# EasyEDA Pro project OSC-chaosheng.eprj, board 主板
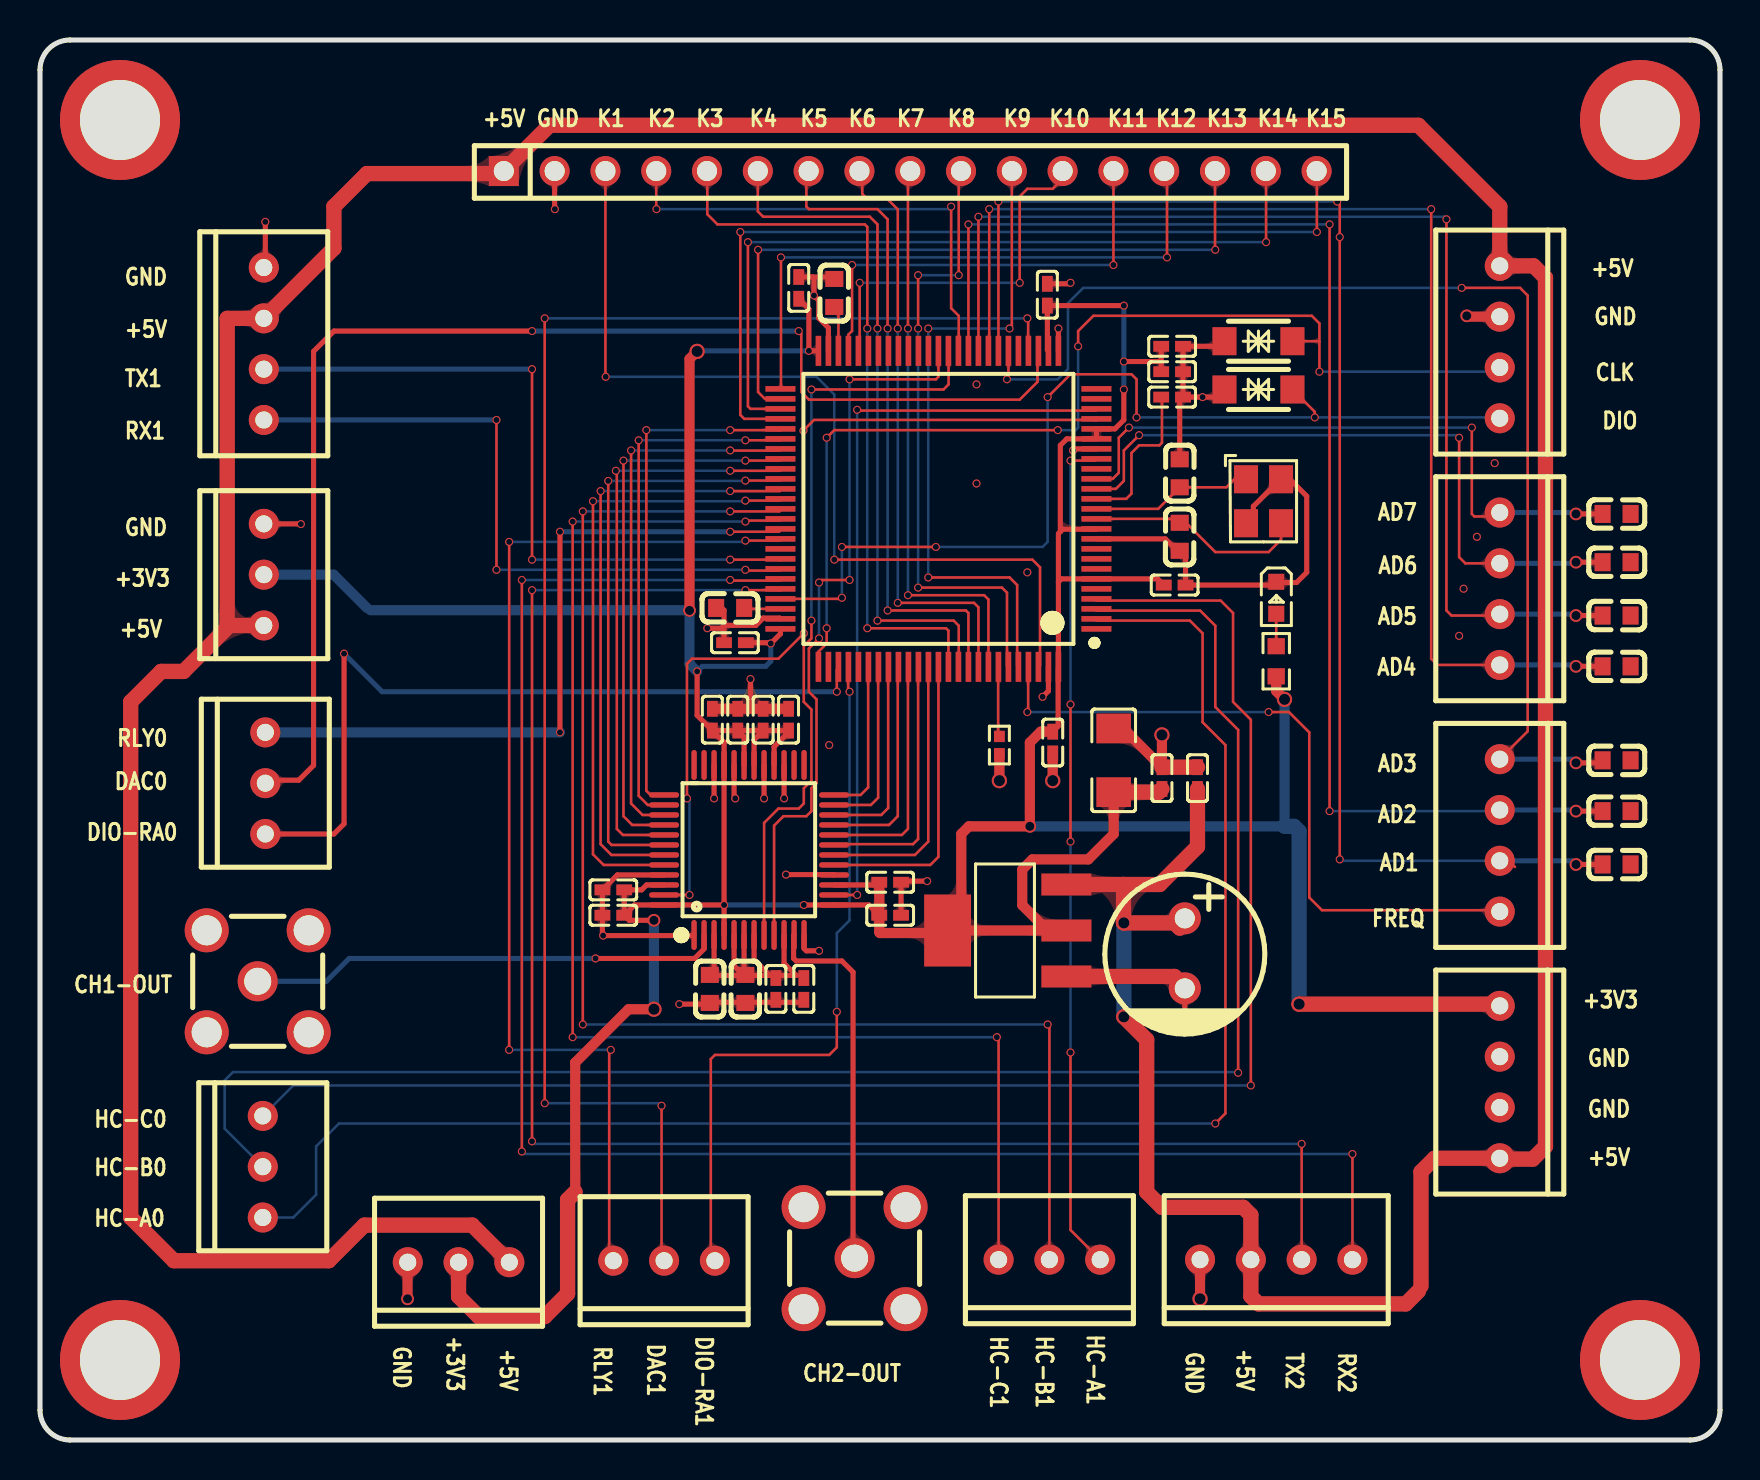
[diagram p11: board, top side]
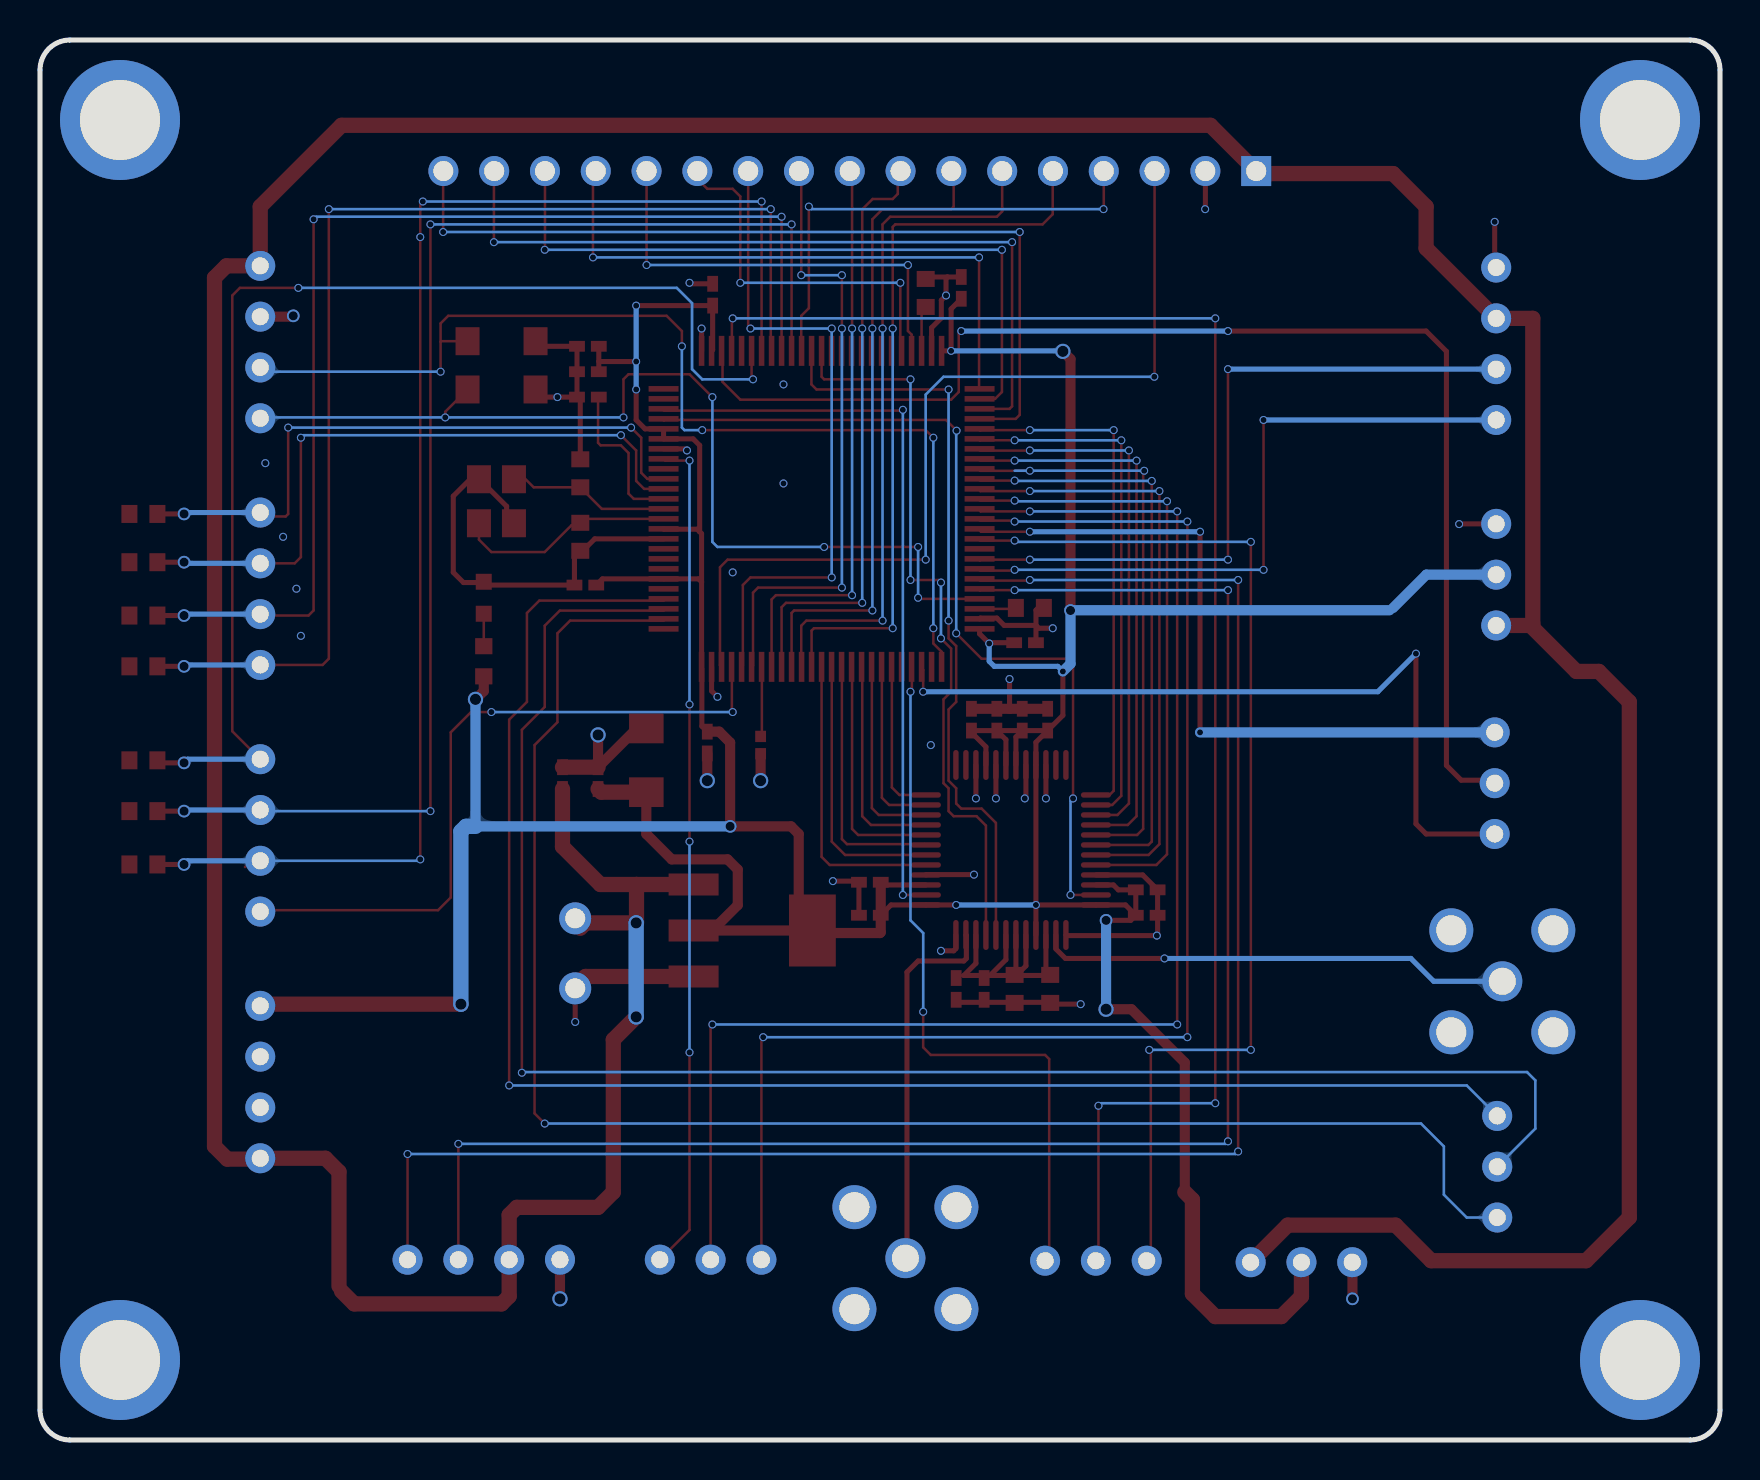
[diagram p12: board, bottom side, seen from below]

Outline 84 x 70 mm; copper layers: Top Layer, Bottom Layer. Coordinates in mm from the lower left corner of the outline.
Outline path: 0,68.5 0,1.5 arc(0.44,0.44) 1.5,0 82.5,0 arc(83.56,0.44) 84,1.5 84,68.5 arc(83.56,69.56) 82.5,70 1.5,70 arc(0.44,69.56) 0,68.5
Stack: Top Layer 0.035mm / Dielectric1 1.51mm FR4 er 4.5 / Bottom Layer 0.035mm

## Design rules (mm)
template: 自定义配置
spacing copperThickness1oz (default): track to track 0.107, other pairs 0.107 to 0.107
spacing copperThickness2oz: track to track 0.203, other pairs 0.152 to 0.3
track width copperThickness1oz (default): min 0.127, default 0.254, max 2.54
track width copperThickness2oz: min 0.203, default 0.254, max 2.54
track width VCCandGND: min 0.254, default 0.762, max 2.54
differential pair differentialPair (default): width min 0.127, default 0.254, max 2.54; gap min 0.152, default 0.152
via viaSize (default): diameter min 0.3, default 0.61, max 10; hole min 0.15, default 0.305, max 6.299
net GND uses VCCandGND
net +3V3 uses VCCandGND
net +5V uses VCCandGND

## Placement (name value [footprint] x y rotation side)
C1  100nF  [C0402]  34.89 36.02 270 top
C2  100nF  [C0402]  36.16 36.02 270 top
C3  100nF  [C0402]  37.43 36.02 270 top
C4  100nF  [C0402]  42.51 27.89 180 top
C5  100nF  [C0402]  33.62 36.02 270 top
C6  100nF  [C0402]  28.66 27.51 0 top
C7  100nF  [C0402]  28.66 26.24 0 top
C8  100nF  [C0402]  42.51 26.24 180 top
C11  22uF  [C0603]  35.27 22.55 90 top
C12  22uF  [C0603]  33.49 22.55 90 top
C14  100nF  [C0402]  56.6 52.14 0 top
C16  22uF  [C0603]  34.51 41.6 0 top
C20  22uF  [C0603]  39.71 57.35 90 top
C21  100nF  [C0402]  34.75 39.86 0 top
C22  100nF  [C0402]  50.64 34.87 90 top
C23  100nF  [C0402]  56.73 42.75 180 top
C24  100nF  [C0402]  37.94 57.61 270 top
C25  100nF  [C0402]  56.6 53.42 180 top
C26  100nF  [C0402]  56.6 54.69 180 top
C27  100nF  [C0402]  50.37 57.26 270 top
C28  100nF  [C0402]  38.19 22.55 90 top
C29  100nF  [C0402]  36.79 22.55 90 top
C32  22pF  [C0603]  56.99 45.16 90 top
C33  22pF  [C0603]  56.99 48.33 270 top
C38  100nF  [C0402]  57.88 33.09 270 top
C39  100nF  [C0402]  56.1 33.09 270 top
C40  100uF  [C1206]  53.68 33.98 270 top
C41  470uF  [CAP-TH_BD8.0-P3.50-D0.6-FD_1]  57.24 24.33 270 top
C42  330nF  [C0603]  78.83 28.78 180 top
C43  330nF  [C0603]  78.83 31.44 180 top
C44  330nF  [C0603]  78.83 33.98 180 top
C45  330nF  [C0603]  78.83 38.68 180 top
C46  330nF  [C0603]  78.83 41.22 180 top
C47  330nF  [C0603]  78.83 43.89 180 top
C48  330nF  [C0603]  78.83 46.3 180 top
J1  -  [CH2.54-4插座]  11.19 54.81 90 top
J2  -  [CH2.54-4插座]  61.81 9.02 180 top
J3  -  [CH2.54-4插座]  72.99 17.9 270 top
J4  -  [CH2.54-17P]  43.52 63.4 0 top
J5  SWD  [CH2.54-4插座]  72.99 54.9 270 top
J6  -  [CH2.54-3插座]  11.19 43.27 90 top
J7  -  [CH2.54-3插座]  20.93 8.89 180 top
J8  -  [CH2.54-4插座]  72.99 30.23 270 top
J11  -  [CH2.54-4插座]  72.99 42.56 270 top
J12  -  [CH2.54-3插座]  11.14 13.66 90 top
J13  -  [CH2.54-3插座]  50.47 9.02 180 top
J14  -  [CH2.54-3插座]  11.27 32.84 90 top
J15  -  [CH2.54-3插座]  31.21 8.97 180 top
LED1  KT-0603R  [LED0603-RD]  61.81 42.11 270 top
NOREF  -  [Pad_e11814]  4 4 0 top
NOREF#2  -  [Pad_e11812]  80 66 0 top
NOREF#3  -  [Pad_e11815]  80 4 0 top
NOREF#4  -  [Pad_e11813]  4 66 0 top
R1  10kΩ  [R0402]  47.97 34.75 270 top
R4  5.1kΩ  [R0603]  61.81 38.94 90 top
RF4  BWSMA-KE-Z001  [SMA-TH_BWSMA-KE-Z001]  10.89 22.94 0 top
RF5  BWSMA-KE-Z001  [SMA-TH_BWSMA-KE-Z001]  40.73 9.09 0 top
U1  STM32H750VBT6TR  [QFP-100_L14.0-W14.0-P0.50-LS16.0-BL]  44.92 46.56 90 top
U2  AD9288BSTZ-100  [LQFP-48_L7.0-W7.0-P0.50-LS9.0-BL]  35.45 29.5 0 top
U6  SMF7.5CA  [SOD-123FL_L2.8-W1.8-LS3.7-BI]  60.92 52.53 180 top
U7  SMF7.5CA  [SOD-123FL_L2.8-W1.8-LS3.7-BI]  60.92 54.94 180 top
U8  AMS1117-3.3  [SOT-223-3_L6.5-W3.4-P2.30-LS7.0-BR]  48.35 25.47 0 top
X2  25MHz  [OSC-SMD_4P-L3.2-W2.5-BL]  61.18 46.94 270 top

## Footprints (pads in the part's own frame, mm; a bottom-side part is the same pattern mirrored in y, then rotated)
C0402
  rect 0.79x0.54 smd: 1(-0.545,0) 2(0.545,0)
C0603
  rect 0.8x0.9 smd: 1(-0.7,0) 2(0.7,0)
C1206
  rect 1.485x1.728 smd: 1(-1.593,0) 2(1.593,0)
CAP-TH_BD8.0-P3.50-D0.6-FD_1
  round 1.6 hole 1: 1(-1.75,0) 2(1.75,0)
CH2.54-3插座
  round 1.5 hole 0.85: 1(-2.54,0) 2(0,0) 3(2.54,0)
CH2.54-4插座
  round 1.5 hole 0.85: 1(-3.81,0) 2(-1.27,0) 3(1.27,0) 4(3.81,0)
CH2.54-17P
  rect 1.5x1.5 hole 1: 1(-20.332,0.051)
  round 1.5 hole 1: 2(-17.793,0.051) 3(-15.252,0.051) 4(-12.713,0.051) 5(-10.172,0.051) 6(-7.633,0.051) 7(-5.093,0.051) 8(-2.553,0.051) 9(-0.013,0.051) 10(2.527,0.051) 11(5.067,0.051) 12(7.607,0.051) 13(10.148,0.051) 14(12.688,0.051) 15(15.227,0.051) 16(17.767,0.051) 17(20.308,0.051)
LED0603-RD
  rect 0.8x0.8 smd: 1(-0.799,0) 2(0.799,0)
LQFP-48_L7.0-W7.0-P0.50-LS9.0-BL
  oval 0.27x1.5 smd: 1(-2.75,-4.25) 2(-2.25,-4.25) 3(-1.75,-4.25) 4(-1.25,-4.25) 5(-0.75,-4.25) 6(-0.25,-4.25) 7(0.25,-4.25) 8(0.75,-4.25) 9(1.25,-4.25) 10(1.75,-4.25) 11(2.25,-4.25) 12(2.75,-4.25) 25(2.75,4.25) 26(2.25,4.25) 27(1.75,4.25) 28(1.25,4.25) 29(0.75,4.25) 30(0.25,4.25) 31(-0.25,4.25) 32(-0.75,4.25) 33(-1.25,4.25) 34(-1.75,4.25) 35(-2.25,4.25) 36(-2.75,4.25)
  oval 1.5x0.27 smd: 13(4.25,-2.75) 14(4.25,-2.25) 15(4.25,-1.75) 16(4.25,-1.25) 17(4.25,-0.75) 18(4.25,-0.25) 19(4.25,0.25) 20(4.25,0.75) 21(4.25,1.25) 22(4.25,1.75) 23(4.25,2.25) 24(4.25,2.75) 37(-4.25,2.75) 38(-4.25,2.25) 39(-4.25,1.75) 40(-4.25,1.25) 41(-4.25,0.75) 42(-4.25,0.25) 43(-4.25,-0.25) 44(-4.25,-0.75) 45(-4.25,-1.25) 46(-4.25,-1.75) 47(-4.25,-2.25) 48(-4.25,-2.75)
OSC-SMD_4P-L3.2-W2.5-BL
  rect 1.4x1.2 smd: 1(-1.1,-0.875) 2(1.1,-0.875) 3(1.1,0.875) 4(-1.1,0.875)
Pad_e11812
  round 6 hole 4: 2(0,0)
Pad_e11813
  round 6 hole 4: 1(0,0)
Pad_e11814
  round 6 hole 4: 3(0,0)
Pad_e11815
  round 6 hole 4: 4(0,0)
QFP-100_L14.0-W14.0-P0.50-LS16.0-BL
  rect 0.28x1.5 smd: 1(-6,-7.9) 2(-5.5,-7.9) 3(-5,-7.9) 4(-4.5,-7.9) 5(-4,-7.9) 6(-3.5,-7.9) 7(-3,-7.9) 8(-2.5,-7.9) 9(-2,-7.9) 10(-1.5,-7.9) 11(-1,-7.9) 12(-0.5,-7.9) 13(0,-7.9) 14(0.5,-7.9) 15(1,-7.9) 16(1.5,-7.9) 17(2,-7.9) 18(2.5,-7.9) 19(3,-7.9) 20(3.5,-7.9) 21(4,-7.9) 22(4.5,-7.9) 23(5,-7.9) 24(5.5,-7.9) 25(6,-7.9) 51(6,7.9) 52(5.5,7.9) 53(5,7.9) 54(4.5,7.9) 55(4,7.9) 56(3.5,7.9) 57(3,7.9) 58(2.5,7.9) 59(2,7.9) 60(1.5,7.9) 61(1,7.9) 62(0.5,7.9) 63(0,7.9) 64(-0.5,7.9) 65(-1,7.9) 66(-1.5,7.9) 67(-2,7.9) 68(-2.5,7.9) 69(-3,7.9) 70(-3.5,7.9) 71(-4,7.9) 72(-4.5,7.9) 73(-5,7.9) 74(-5.5,7.9) 75(-6,7.9)
  rect 1.5x0.28 smd: 26(7.9,-6) 27(7.9,-5.5) 28(7.9,-5) 29(7.9,-4.5) 30(7.9,-4) 31(7.9,-3.5) 32(7.9,-3) 33(7.9,-2.5) 34(7.9,-2) 35(7.9,-1.5) 36(7.9,-1) 37(7.9,-0.5) 38(7.9,0) 39(7.9,0.5) 40(7.9,1) 41(7.9,1.5) 42(7.9,2) 43(7.9,2.5) 44(7.9,3) 45(7.9,3.5) 46(7.9,4) 47(7.9,4.5) 48(7.9,5) 49(7.9,5.5) 50(7.9,6) 76(-7.9,6) 77(-7.9,5.5) 78(-7.9,5) 79(-7.9,4.5) 80(-7.9,4) 81(-7.9,3.5) 82(-7.9,3) 83(-7.9,2.5) 84(-7.9,2) 85(-7.9,1.5) 86(-7.9,1) 87(-7.9,0.5) 88(-7.9,0) 89(-7.9,-0.5) 90(-7.9,-1) 91(-7.9,-1.5) 92(-7.9,-2) 93(-7.9,-2.5) 94(-7.9,-3) 95(-7.9,-3.5) 96(-7.9,-4) 97(-7.9,-4.5) 98(-7.9,-5) 99(-7.9,-5.5) 100(-7.9,-6)
R0402
  rect 0.566x0.54 smd: 1(-0.433,0) 2(0.433,0)
R0603
  rect 0.806x0.864 smd: 1(-0.753,0) 2(0.753,0)
SMA-TH_BWSMA-KE-Z001
  round 2.2 hole 1.5: 1(-2.55,-2.55) 2(-2.55,2.55) 3(2.55,2.55) 4(2.55,-2.55)
  round 2 hole 1.35: 5(0,0)
SOD-123FL_L2.8-W1.8-LS3.7-BI
  rect 1.2x1.4 smd: 1(-1.7,0) 2(1.7,0)
SOT-223-3_L6.5-W3.4-P2.30-LS7.0-BR
  rect 2.5x1.1 smd: 1(2.97,-2.3) 2(2.97,0) 3(2.97,2.3)
  rect 2.34x3.6 smd: 4(-2.97,0)

## Nets
+3V3: C1.2 C2.2 C3.2 C4.2 C5.2 C6.2 C7.2 C8.2 C21.2 C22.2 C23.2 C24.2 C25.2 C26.2 C27.2 C39.2 C40.2 J3.1 J6.2 J7.2 R4.1 U1.6 U1.11 U1.20 U1.21 U1.27 U1.50 U1.75 U1.100 U2.4 U2.13 U2.15 U2.28 U2.30 U2.31 U2.33 U2.46 U2.48 U8.2 U8.4
+5V: C38.2 C41.1 J1.3 J2.3 J3.4 J4.1 J5.1 J6.1 J7.1 U8.3
GND: C1.1 C2.1 C3.1 C4.1 C5.1 C6.1 C7.1 C8.1 C11.1 C12.1 C14.2 C16.1 C20.2 C21.1 C22.1 C23.1 C24.1 C25.1 C26.1 C27.1 C28.1 C29.1 C32.1 C33.1 C38.1 C39.1 C40.1 C41.2 C42.1 C43.1 C44.1 C45.1 C46.1 C47.1 C48.1 J1.4 J2.4 J3.2 J3.3 J4.2 J5.2 J6.3 J7.3 LED1.1 NOREF.3 NOREF#2.2 NOREF#3.4 NOREF#4.1 R1.2 RF4.1 RF4.2 RF4.3 RF4.4 RF5.1 RF5.2 RF5.3 RF5.4 U1.10 U1.19 U1.26 U1.49 U1.74 U1.99 U2.1 U2.12 U2.16 U2.27 U2.29 U2.32 U2.34 U2.45 U6.2 U7.2 U8.1 X2.2 X2.4
AD1: C42.2 J8.3 U1.32
AD2: C43.2 J8.2 U1.35
AD3: C44.2 J8.1 U1.31
AD4: C45.2 J11.4 U1.33
AD5: C46.2 J11.3 U1.34
AD6: C47.2 J11.2 U1.15
AD7: C48.2 J11.1 U1.16
CH1-OUT: RF4.5 U2.2
CH2-OUT: RF5.5 U2.11
CLK: J5.3 U1.76 U7.1
DA0: U1.55 U2.37
DA1: U1.56 U2.38
DA2: U1.57 U2.39
DA3: U1.58 U2.40
DA4: U1.59 U2.41
DA5: U1.60 U2.42
DA6: U1.61 U2.43
DA7: U1.62 U2.44
DAC0: J14.2 U1.28
DAC1: J15.2 U1.29
DB0: U1.81 U2.24
DB1: U1.82 U2.23
DB2: U1.83 U2.22
DB3: U1.84 U2.21
DB4: U1.85 U2.20
DB5: U1.86 U2.19
DB6: U1.87 U2.18
DB7: U1.88 U2.17
DIO: J5.4 U1.72 U6.1
DIO-CLKA: U1.22 U2.47
DIO-CLKB: U1.23 U2.14
DIO-RA0: J14.1 U1.78
DIO-RA1: J15.1 U1.79
DIO-S1: U1.37 U2.8
DIO-S2: U1.38 U2.9
FREQ: J8.4 U1.97
HC-A0: J12.1 U1.2
HC-A1: J13.1 U1.18
HC-B0: J12.2 U1.3
HC-B1: J13.2 U1.63
HC-C0: J12.3 U1.4
HC-C1: J13.3 U1.64
K1: J4.3 U1.98
K2: J4.4 U1.36
K3: J4.5 U1.89
K4: J4.6 U1.90
K5: J4.7 U1.91
K6: J4.8 U1.92
K7: J4.9 U1.93
K8: J4.10 U1.95
K9: J4.11 U1.96
K10: J4.12 U1.46
K11: J4.13 U1.47
K12: J4.14 U1.51
K13: J4.15 U1.52
K14: J4.16 U1.53
K15: J4.17 U1.54
OSC_IN: C32.2 U1.12 X2.3
OSC_OUT: C33.2 U1.13 X2.1
REFO: C11.2 C12.2 C28.2 C29.2 U2.3 U2.5 U2.6 U2.7 U2.10
RLY0: J14.3 U1.65
RLY1: J15.3 U1.66
RX1: J1.1 U1.69
RX2: J2.1 U1.70
TX1: J1.2 U1.68
TX2: J2.2 U1.71
$1N7062: C14.1 U1.14
$1N7469: C20.1 U1.48
$1N8680: R1.1 U1.94
$1N14131: C16.2 U1.73
$1N14803: LED1.2 R4.2

Pads without a net: U1 1 5 7 8 9 17 24 25 30 39 40 41 42 43 44 45 67 77 80; U2 25 26 35 36

## Via types
v1: diameter 0.4, hole 0.3, Top Layer to Bottom Layer, 175 vias
v2: diameter 0.762, hole 0.559, Top Layer to Bottom Layer, 10 vias
v3: diameter 0.635, hole 0.457, Top Layer to Bottom Layer, 13 vias

## Routing (per net, layer and track width the routed paths; a pad name or vN(x,y) marks a point on that pad's centre or on a via; arc(x,y) is an arc through that point)
+3V3: length 246.9
  Top Layer w0.254: 50.92,42.91 51.07,43.06 U1.6 55.88,43.06 C23.2 ; 50.92,42.91 U1.100 ; 50.92,42.91 50.92,45.32 51.02,45.41 ; C26.2 56.06,53.99 ; C2.2 C3.2 37.43,35.38 36.7,34.66 U2.28 ; C2.2 C1.2 ; C2.2 35.7,35.02 U2.30 ; C1.2 35.2,35.15 U2.31 ; C1.2 C5.2 ; C21.2 36.5,39.86 v1(36.54,39.83) 37.02,40.31 U1.75 ; C24.2 38.44,56.55 v1(38.44,54.46) 38.92,54.46 ; C25.2 56.06,53.92 v1(54.19,53.92) ; 51.02,45.41 51.14,45.54 52.81,45.54 U1.11 ; 51.02,45.41 51.02,49.73 51.34,50.06 U1.20 U1.21 53.75,50.56 54.19,51 v1(54.19,52.53) ; 50.91,38.57 50.91,35.69 C22.2 ; v1(34.2,26.75) U2.4 ; v1(34.2,26.75) U2.33 34.2,34.88 C5.2 ; v1(34.2,26.75) U2.48 29.72,26.75 C7.2 ; v1(32.86,38.43) 32.86,36.23 C5.2 ; C7.2 C6.2 30.08,27.51 30.33,27.75 U2.46 ; C7.2 29.46,25.98 v3(30.7,25.98) ; 54.19,56.72 C27.2 50.37,54.51 50.42,54.46 ; U2.15 41.83,27.75 C4.2 ; v1(38.19,26.75) U2.13 41.45,26.75 C8.2
  Top Layer w0.508: v2(62.23,37.03) 61.81,37.45 R4.1 ; 50.38,25.47 49.11,26.75 49.11,28.52 49.62,29.03 52.41,29.03 53.68,30.3 C40.2 ; 50.38,25.47 U8.2 ; 50.38,25.47 U8.4 ; v3(32.47,41.48) 32.47,54.05 v2(32.86,54.43) ; C4.2 C8.2 41.96,25.39 42,25.35 44.79,25.35 46.06,26.62 46.06,30.3 46.44,30.68 v3(49.49,30.68) 49.49,34.87 50.04,35.42 C22.2 ; 26.76,12.39 26.76,18.87 29.43,21.54 v3(30.7,21.54)
  Top Layer w0.762: C40.2 55.94,32.39 C39.2 ; J7.2 20.93,7.18 21.93,6.17 25.24,6.17 26.38,7.31 26.38,12.01 26.76,12.39 ; v2(62.96,21.79) 72.9,21.79 J3.1
  Bottom Layer w0.254: v1(36.54,39.83) 36.54,38.94 36.28,38.68 33.11,38.68 v1(32.86,38.43) ; v1(54.19,52.53) v1(54.19,53.92) v1(54.19,56.72) ; v2(32.86,54.43) 32.88,54.46 v1(38.44,54.46) ; v1(34.2,26.75) v1(38.19,26.75)
  Bottom Layer w0.508: v1(32.86,38.43) 32.47,38.81 v3(32.47,41.48) 32.46,41.49 16.52,41.49 ; v2(62.23,37.03) 62.23,30.68 v3(49.49,30.68) ; J6.2 14.68,43.27 16.35,41.6 ; v3(30.7,25.98) v3(30.7,21.54)
  Bottom Layer w0.762: v2(62.96,21.79) 62.96,30.43 62.7,30.68 62.23,30.68
+5V: length 250.4
  Top Layer w0.762: 54.17,27.78 51.32,27.78 ; 54.17,27.78 55.98,27.78 57.88,29.67 C38.2 ; 54.17,27.78 54.17,25.88 v2(54.19,25.86) 56.72,25.86 56.99,25.59 ; J7.1 21.61,10.74 16.22,10.74 14.44,8.97 6.69,8.97 4.53,11.12 4.53,36.91 6.06,38.43 7.18,38.43 9.48,40.73 ; 68.92,7.44 68.29,6.81 60.92,6.81 60.54,7.19 J2.3 60.54,11.25 60.16,11.63 56.1,11.63 55.34,12.39 55.34,20.01 v2(54.19,21.16) ; 9.48,40.73 J6.1 ; 9.48,40.73 9.36,40.73 ; 9.48,40.73 9.36,40.84 9.36,56.08 J1.3 14.69,59.59 14.69,61.67 16.35,63.32 23.06,63.32 J4.1 25.48,65.73 68.92,65.73 72.99,61.67 J5.1 74.68,58.71 75.27,58.11 75.27,14.68 74.64,14.04 73.03,14.04 72.99,14.09 69.73,14.09 69.05,13.41 69.05,7.69
  Bottom Layer w0.762: v2(54.19,21.16) v2(54.19,25.86)
GND: length 111.9
  Top Layer w0.254: v1(31.97,21.79) 33.43,21.79 C12.1 ; v1(13.04,45.8) 13.03,45.81 J6.3 ; U2.34 v1(33.7,32.08) ; v1(35.52,38.05) 35.52,36.58 35.51,36.56 ; C14.2 C25.1 C26.1 58.97,54.69 U7.2 ; C14.2 v1(58.13,52.14) 58.84,52.14 U6.2 ; C14.2 56.99,51.98 C33.1 ; 39.42,54.46 39.42,55.61 38.93,56.1 38.93,56.99 v1(38.7,57.22) 38.7,58.09 38.63,58.15 ; v1(51.53,57.86) 51.47,57.81 C27.1 ; v1(11.27,60.91) 11.27,58.7 J1.4 ; U2.27 v1(37.2,32.08) ; 34.2,40.73 34.06,40.59 v1(33.36,40.59) ; 34.2,40.73 C21.1 ; 34.2,40.73 34.2,41.49 34.09,41.6 C16.1 ; 34.2,40.73 35.79,40.73 36.16,41.1 36.98,41.1 U1.74 ; v1(44.36,27.94) 43.12,27.94 ; U2.16 39.69,28.27 v1(37.3,28.27) ; C24.1 38.63,58.15 ; 38.63,58.15 39.69,58.15 39.71,58.18 ; 33.71,21.8 33.79,21.88 38.06,21.88 38.32,22.14 ; C32.1 57.28,44.17 C23.1 61.65,42.75 LED1.1 61.85,42.87 62.83,42.87 63.34,43.38 63.34,47.19 62.49,48.04 X2.4 62.02,48.04 60.67,46.68 60.67,46.2 X2.2 ; 50.25,37.29 50.42,37.45 U1.99 ; v1(25.74,61.54) 25.73,61.56 J4.2 ; 57.11,22.79 57.24,22.66 v1(57.24,20.9) ; C4.1 C8.1 ; U2.45 28.86,28.25 C6.1 C7.1 28.12,25.26 v1(28.16,25.22) 32.67,25.22 U2.1 ; U2.12 38.2,24.57 38.32,24.46 v1(38.95,24.46) ; U1.10 56.26,45.06 56.99,44.33 ; v1(51.65,49.48) 51.73,49.56 U1.19 ; U2.29 v1(36.2,32.08) ; 50.92,54.46 v1(50.92,55.57) ; U2.32 34.7,32.08
  Top Layer w0.508: v3(71.34,56.21) 71.38,56.17 J5.2 ; C3.1 C2.1 C1.1 C5.1 ; C40.1 54.16,35.58 C39.1 v2(56.1,35.25) ; J7.3 18.38,8.88 v3(18.38,7.06) ; v2(47.97,32.97) R1.2 ; J2.4 v2(58,7.06) ; v2(50.64,32.97) C22.1
  Top Layer w0.762: C38.1 C39.1 ; 57.11,22.79 56.72,23.18 U8.1
  vias: v1(34.76,32.08) v1(39.46,34.75) v1(46.83,52.78) v1(46.83,47.83) v1(49.37,43.38) v1(50.13,37.16) v1(70.96,40.21) v1(71.18,42.56) v1(71.84,45.16) v1(72.73,48.84)
AD1: length 71.6
  Top Layer w0.127: v1(64.99,29.03) v1(64.99,60.15) 64.99,61.8 v1(64.86,61.92) ; J8.3 73.44,28.96 73.75,28.65 ; 47.92,54.46 v1(47.92,61.92)
  Top Layer w0.254: C42.2 v3(76.8,28.78)
  Bottom Layer w0.127: v1(64.86,61.92) v1(47.92,61.92) ; J8.3 65.06,28.96 v1(64.99,29.03) 64.92,28.96
  Bottom Layer w0.254: v3(76.8,28.78) 76.61,28.96 J8.3
AD2: length 67.4
  Top Layer w0.127: v1(64.48,60.78) v1(64.48,31.44) ; 46.42,54.46 v1(46.42,60.78)
  Top Layer w0.254: C43.2 v3(76.8,31.44)
  Bottom Layer w0.127: J8.2 72.93,31.44 v1(64.48,31.44) ; v1(64.48,60.78) v1(46.42,60.78)
  Bottom Layer w0.254: v3(76.8,31.44) 76.74,31.5 J8.2
AD3: length 60.5
  Top Layer w0.127: v1(71.08,57.61) 74,57.61 74.38,57.22 74.38,35.44 J8.1 ; v1(48.35,53.03) 48.42,53.11 48.42,54.46
  Top Layer w0.254: v3(76.8,33.86) 78,33.86 C44.2
  Bottom Layer w0.127: v1(48.35,53.03) 50.89,53.03 51.4,53.54 51.4,56.84 52.16,57.61 v1(71.08,57.61)
  Bottom Layer w0.254: v3(76.8,33.86) 76.61,34.04 J8.1
AD4: length 60.4
  Top Layer w0.127: v1(69.56,61.54) 69.56,39.06 69.87,38.75 J11.4 ; v1(47.46,61.54) 47.46,54.5 47.42,54.46
  Top Layer w0.254: C45.2 v3(76.8,38.68)
  Bottom Layer w0.127: v1(69.56,61.54) v1(47.46,61.54)
  Bottom Layer w0.254: v3(76.8,38.68) 76.73,38.75 J11.4
AD5: length 57.7
  Top Layer w0.127: 46.92,54.46 v1(46.92,61.16) ; J11.3 72.92,41.22 70.57,41.22 70.32,41.48 v1(70.32,61.03)
  Top Layer w0.254: C46.2 v3(76.8,41.22)
  Bottom Layer w0.127: v1(70.32,61.03) 70.19,61.16 v1(46.92,61.16)
  Bottom Layer w0.254: v3(76.8,41.22) 76.73,41.29 J11.3
AD6: length 33.5
  Top Layer w0.127: v1(70.96,50.11) 70.96,44.14 71.27,43.83 J11.2 ; v1(54.95,50.24) 54.19,49.48 54.19,47.95 53.79,47.56 U1.15
  Top Layer w0.254: C47.2 v3(76.8,43.89)
  Bottom Layer w0.127: v1(54.95,50.24) 70.83,50.24 v1(70.96,50.11)
  Bottom Layer w0.254: J11.2 76.74,43.83 v3(76.8,43.89)
AD7: length 31.9
  Top Layer w0.127: J11.1 72.79,46.18 71.72,46.18 71.59,46.3 v1(71.59,50.62) ; v1(54.45,50.62) 53.94,50.11 53.94,48.36 53.63,48.06 U1.16
  Top Layer w0.254: C48.2 v3(76.8,46.3)
  Bottom Layer w0.127: v1(71.59,50.62) v1(54.45,50.62)
  Bottom Layer w0.254: J11.1 76.73,46.37 v3(76.8,46.3)
CH1-OUT: length 23.7
  Top Layer w0.254: U2.2 33.2,24.55 32.73,24.08 v1(27.78,24.08)
  Bottom Layer w0.254: RF4.5 14.31,22.94 15.46,24.08 v1(27.78,24.08)
CH2-OUT: length 18.6
  Top Layer w0.254: U2.11 37.68,25.23 37.68,24.08 37.81,23.95 40.09,23.95 40.65,23.39 40.65,9.27
CLK: length 54.7
  Top Layer w0.127: 63.97,54.91 v1(63.97,53.42) ; 63.97,54.91 63.97,55.83 63.59,56.21 52.67,56.21 51.91,55.45 v1(51.91,54.69) ; 63.97,54.91 63.95,54.94 U7.1 ; v1(39.33,50.11) 39.71,50.49 v1(50.89,50.49) ; v1(39.33,40.59) 39.33,39.83 38.92,39.41 U1.76
  Bottom Layer w0.127: J5.3 72.78,53.42 v1(63.97,53.42) ; v1(50.89,50.49) 51.78,50.49 51.91,50.62 v1(51.91,54.69) ; v1(39.33,40.59) v1(39.33,50.11)
DA0: length 25.8
  Top Layer w0.127: v1(34.51,50.49) 36.96,50.49 U1.55 ; v1(30.32,50.49) 30.32,32.46 30.52,32.25 U2.37 ; 36.98,50.49 37.01,50.47
  Bottom Layer w0.127: v1(34.51,50.49) v1(30.32,50.49)
DA1: length 26.3
  Top Layer w0.127: 37.01,49.97 36.99,49.99 v1(35.27,49.99) ; v1(29.94,49.99) 29.94,32.21 30.39,31.75 U2.38
  Bottom Layer w0.127: v1(29.94,49.99) v1(35.27,49.99)
DA2: length 27
  Top Layer w0.127: v1(29.55,49.48) 29.55,31.83 30.13,31.25 U2.39 ; v1(34.51,49.48) 34.52,49.47 37.01,49.47
  Bottom Layer w0.127: v1(34.51,49.48) v1(29.55,49.48)
DA3: length 27.8
  Top Layer w0.127: U2.40 29.61,30.75 29.17,31.19 v1(29.17,48.97) ; 37.01,48.97 35.27,48.97
  Bottom Layer w0.127: v1(29.17,48.97) v1(35.27,48.97)
DA4: length 29.4
  Top Layer w0.127: 37.01,48.47 37,48.46 34.51,48.46 ; U2.41 29.15,30.25 28.84,30.56 28.84,48.41 v1(28.79,48.46)
  Bottom Layer w0.127: v1(28.79,48.46) v1(34.51,48.46) 35.27,48.46
DA5: length 29.5
  Top Layer w0.127: v1(28.41,47.95) 28.41,29.92 28.58,29.75 U2.42 ; 37.01,47.97 35.27,47.97
  Bottom Layer w0.127: v1(35.27,47.97) 35.25,47.95 v1(28.41,47.95)
DA6: length 30
  Top Layer w0.127: 37.01,47.47 36.98,47.44 34.51,47.44 ; U2.43 28.57,29.25 28.03,29.79 v1(28.03,47.45)
  Bottom Layer w0.127: v1(34.51,47.45) v1(28.03,47.45)
DA7: length 30.8
  Top Layer w0.127: v1(27.65,46.94) 27.65,29.28 28.18,28.75 U2.44 ; 37.01,46.97 35.27,46.97
  Bottom Layer w0.127: v1(27.65,46.94) 35.24,46.94 v1(35.27,46.97)
DAC0: length 65.2
  Top Layer w0.127: v1(37.94,55.45) 38.06,55.32 38.06,52.4 38.44,52.02 48.99,52.02 49.87,52.91 49.87,54.41 49.92,54.46
  Top Layer w0.254: 11.19,32.99 12.94,32.99 13.68,33.73 13.68,54.43 14.69,55.45 v1(24.6,55.45)
  Bottom Layer w0.254: v1(24.6,55.45) v1(37.94,55.45)
DAC1: length 78.9
  Top Layer w0.127: 49.41,54.37 49.41,56.04 v1(49.37,56.08) ; v1(31.08,16.71) 31.08,8.97 31,8.89 ; v1(25.24,56.08) v1(25.24,16.84)
  Bottom Layer w0.127: v1(31.08,16.71) 30.95,16.84 v1(25.24,16.84) ; v1(25.24,56.08) v1(49.37,56.08)
DB0: length 7.8
  Top Layer w0.127: U2.24 41.03,32.25 41.41,32.63 41.41,38.57
DB1: length 8.9
  Top Layer w0.127: 41.87,38.53 41.91,38.57 41.91,32.11 41.55,31.75 U2.23
DB2: length 9.8
  Top Layer w0.127: 42.41,38.57 42.41,31.6 42.06,31.25 U2.22
DB3: length 10.8
  Top Layer w0.127: 42.91,38.57 42.89,38.55 42.89,31.19 42.45,30.75 U2.21
DB4: length 11.8
  Top Layer w0.127: 43.41,38.57 43.4,38.56 43.4,30.56 43.09,30.25 U2.20
DB5: length 12.8
  Top Layer w0.127: 43.91,38.57 43.91,38.57 43.91,30.05 43.65,29.79 39.75,29.79 U2.19
DB6: length 13.6
  Top Layer w0.127: U2.18 43.74,29.25 44.41,29.92 44.41,38.56
DB7: length 14.8
  Top Layer w0.127: 44.91,38.57 44.92,38.56 44.92,29.16 44.51,28.75 U2.17 39.73,28.78
DIO: length 50.2
  Top Layer w0.127: v1(40.09,44.65) v1(44.79,44.65) ; U6.1 63.74,51.41 v1(63.74,51.13) ; U1.72 40.09,42.06 ; v1(54.83,51.13) 54.83,53.03 54.57,53.29 51.53,53.29 v1(50.38,52.14)
  Bottom Layer w0.127: v1(40.09,42.11) v1(40.09,44.65) ; v1(54.83,51.13) v1(63.74,51.13) 72.95,51.13 J5.4 ; v1(50.38,52.14) 50.38,44.91 50.13,44.65 v1(44.79,44.65)
DIO-CLKA: length 44.4
  Top Layer w0.127: v1(38.19,40.33) 36.92,39.06 32.6,39.06 32.35,38.81 v1(32.35,32.08) ; 52.81,50.97 52.77,51 38.7,51 38.19,50.49 ; v1(32.47,27.25) U2.47
  Bottom Layer w0.127: v1(38.19,40.33) 38.19,50.49 ; v1(32.47,27.25) 32.47,31.95 v1(32.35,32.08)
  vias: v1(38.17,50.47)
DIO-CLKB: length 37.4
  Top Layer w0.127: 52.81,51.47 40.86,51.47 ; U2.14 v1(40.86,27.25)
  Bottom Layer w0.127: v1(40.86,27.25) v1(40.86,51.51)
DIO-RA0: length 39.4
  Top Layer w0.127: 39.91,38.57 39.84,38.5 v1(39.84,37.41)
  Top Layer w0.254: 11.19,30.45 11.34,30.3 14.69,30.3 15.2,30.81 v1(15.2,39.32)
  Bottom Layer w0.254: v1(15.2,39.32) 17.11,37.41 v1(39.84,37.41)
DIO-RA1: length 35.9
  Top Layer w0.127: v1(40.48,37.41) 40.41,37.48 40.41,38.57 ; v1(39.84,21.41) 39.84,19.63 39.46,19.25 33.75,19.25 33.54,19.05 33.54,8.89
  Bottom Layer w0.127: v1(40.48,37.41) 40.48,25.98 39.84,25.35 v1(39.84,21.41)
DIO-S1: length 37.8
  Top Layer w0.127: 45.42,54.46 45.43,54.45 45.43,52.78 45.18,52.53 v1(38.57,52.53) ; v1(38.57,40.97) 38.57,40.08 38.19,39.7 38.19,36.91 38.57,36.52 38.57,32.97 38.19,32.59 38.19,31.83 37.94,31.57 36.92,31.57 36.2,30.86 U2.8
  Bottom Layer w0.127: v1(38.57,52.53) v1(38.57,40.97)
DIO-S2: length 36.9
  Top Layer w0.127: U2.9 36.7,30.72 37.17,31.19 38.32,31.19 38.57,31.44 38.57,32.59 38.82,32.84 38.82,37.03 38.44,37.41 38.44,39.57 v1(38.95,40.08) ; v1(40.48,43) 39.08,43 v1(38.95,42.87) ; 44.92,54.46 44.92,53.16 44.79,53.03 v1(40.48,53.03)
  Bottom Layer w0.127: v1(40.48,53.03) v1(40.48,43) ; v1(38.95,40.08) v1(38.95,42.87)
FREQ: length 34.8
  Top Layer w0.127: J8.4 72.92,26.49 64.1,26.49 63.46,27.13 63.46,35.38 62.45,36.4 v1(61.43,36.4) ; 49.41,38.57 49.41,36.44 v1(49.37,36.4)
  Bottom Layer w0.127: v1(61.43,36.4) v1(49.37,36.4)
HC-A0: length 81.8
  Top Layer w0.127: v1(58.76,15.82) 59.27,16.33 59.27,34.75 58.13,35.89 58.13,40.33 57.49,40.97 52.81,40.97
  Bottom Layer w0.127: J12.1 12.66,11.12 13.81,12.27 13.81,14.68 14.95,15.82 v1(58.76,15.82)
HC-A1: length 41.9
  Top Layer w0.127: v1(51.53,19.38) 51.53,10.5 J13.1 ; v1(51.53,48.97) 52.73,48.97 U1.18 ; v1(51.53,29.92) v1(51.53,36.78)
  Bottom Layer w0.127: v1(51.53,48.97) v1(51.53,36.78) ; v1(51.53,19.38) v1(51.53,29.92)
HC-B0: length 85.1
  Top Layer w0.127: v1(59.91,18.36) 59.91,35.51 58.76,36.65 58.76,40.72 58.01,41.47 52.81,41.47
  Bottom Layer w0.127: J12.2 9.23,15.57 9.23,17.98 9.65,18.4 59.87,18.4 v1(59.91,18.36)
HC-B1: length 70.6
  Top Layer w0.127: 37.01,46.47 36.97,46.43 34.51,46.43 ; v1(50.38,20.78) 50.47,20.69 J13.2 ; v1(27.14,46.43) v1(27.14,20.78)
  Bottom Layer w0.127: v1(34.51,46.43) v1(27.14,46.43) ; v1(50.38,20.78) v1(27.14,20.78)
HC-C0: length 81.1
  Top Layer w0.127: v1(60.54,17.73) 60.54,36.02 59.65,36.91 59.65,41.35 59.03,41.97 52.81,41.97
  Bottom Layer w0.127: J12.3 12.66,17.73 v1(60.54,17.73)
HC-C1: length 68.5
  Top Layer w0.127: J13.3 47.93,20.14 ; 37.01,45.97 35.32,45.97 v1(35.27,45.92) ; v1(26.63,45.92) v1(26.63,20.14)
  Bottom Layer w0.127: v1(35.27,45.92) v1(26.63,45.92) ; v1(47.84,20.14) v1(26.63,20.14)
K1: length 45.8
  Top Layer w0.127: v1(28.28,53.16) 28.27,53.17 J4.3 ; U1.98 50,38.74 50,43.64 49.62,44.02 v1(39.71,44.02)
  Bottom Layer w0.127: v1(28.28,53.16) 38.82,53.16 39.71,52.27 v1(39.71,44.02)
K2: length 24.1
  Top Layer w0.127: J4.4 30.81,61.56 v1(30.82,61.54) ; 45.92,54.46 45.94,54.47 45.94,56.21 45.56,56.59 v1(45.56,61.67)
  Bottom Layer w0.127: v1(30.82,61.54) 45.43,61.54 v1(45.56,61.67)
K3: length 36.4
  Top Layer w0.127: v1(41.37,55.57) 41.37,60.65 41.24,60.78 33.87,60.78 33.36,61.29 33.36,63.44 J4.5 ; v1(41.37,40.59) 45.3,40.59 45.42,40.47 U1.89
  Bottom Layer w0.127: v1(41.37,40.59) v1(41.37,55.57)
K4: length 34.3
  Top Layer w0.127: J4.6 35.89,61.43 36.16,61.16 41.49,61.16 41.87,60.78 v1(41.87,55.57) ; v1(41.87,40.97) 45.68,40.97 45.94,40.72 45.94,38.67 U1.90
  Bottom Layer w0.127: v1(41.87,55.57) v1(41.87,40.97)
K5: length 32.5
  Top Layer w0.127: U1.91 46.42,41.35 46.29,41.48 v1(42.38,41.48) ; v1(42.38,55.57) 42.38,61.03 41.87,61.54 38.44,61.54 38.32,61.67 38.32,63.33 J4.7
  Bottom Layer w0.127: v1(42.38,41.48) v1(42.38,55.57)
K6: length 30.1
  Top Layer w0.127: U1.92 46.92,41.64 46.7,41.86 v1(42.89,41.86) ; v1(42.89,55.57) 42.89,61.53 42.37,62.05 41.37,62.05 41.11,62.31 41.11,63.31 J4.8
  Bottom Layer w0.127: v1(42.89,41.86) v1(42.89,55.57)
K7: length 28.7
  Top Layer w0.127: U1.93 47.42,42.03 47.21,42.24 v1(43.4,42.24) ; v1(43.4,55.57) 43.4,63.33 J4.9
  Bottom Layer w0.127: v1(43.4,42.24) v1(43.4,55.57)
K8: length 31.2
  Top Layer w0.127: v1(43.91,42.62) 48.1,42.62 48.35,42.37 48.35,38.73 U1.95 ; v1(43.91,58.24) v1(43.91,55.57) ; v1(45.94,58.24) 45.94,63.33 J4.10
  Bottom Layer w0.127: v1(45.94,58.24) v1(43.91,58.24) ; v1(43.91,42.62) v1(43.91,55.57)
K9: length 33.2
  Top Layer w0.127: J4.11 48.59,55.69 v1(48.48,55.57) ; U1.96 48.86,38.72 48.86,42.75 48.48,43.13 v1(44.41,43.13)
  Bottom Layer w0.127: v1(48.48,55.57) v1(44.41,55.57) v1(44.41,43.13)
K10: length 18.7
  Top Layer w0.127: v1(40.98,57.86) 40.98,54.52 40.92,54.46 ; J4.12 51.24,63.34 51.24,63.16 50.64,62.56 49.37,62.56 48.99,62.18 v1(48.99,57.86)
  Bottom Layer w0.127: v1(48.99,57.86) v1(40.98,57.86)
K11: length 22
  Top Layer w0.127: 40.42,54.46 40.42,55.27 40.6,55.45 v1(40.6,58.75) ; J4.13 v1(53.67,58.75)
  Bottom Layer w0.127: v1(53.67,58.75) 40.73,58.75
K12: length 30.3
  Top Layer w0.127: v1(56.35,59.13) 56.35,63.31 J4.14 ; U1.51 37.05,52.58 v1(37.05,59.13)
  Bottom Layer w0.127: v1(37.05,59.13) v1(56.35,59.13)
K13: length 35.2
  Top Layer w0.127: U1.52 36.25,52.06 35.9,52.4 v1(35.9,59.51) ; v1(58.76,59.51) 58.75,59.52 J4.15
  Bottom Layer w0.127: v1(35.9,59.51) v1(58.76,59.51)
K14: length 39.4
  Top Layer w0.127: U1.53 35.52,51.56 35.4,51.68 v1(35.4,59.89) ; v1(61.3,59.89) 61.3,63.44 J4.16
  Bottom Layer w0.127: v1(61.3,59.89) v1(35.4,59.89)
K15: length 43.1
  Top Layer w0.127: v1(35.01,60.4) 35.01,51.26 35.21,51.06 U1.54 ; v1(63.84,60.4) 63.84,63.44 J4.17
  Bottom Layer w0.127: v1(63.84,60.4) v1(35.01,60.4)
OSC_IN: length 11
  Top Layer w0.127: X2.3 62.05,45.02 61.43,44.4 58.76,44.4 57.43,45.73 56.99,45.73 56.66,46.06 U1.12
OSC_OUT: length 8.3
  Top Layer w0.127: 60.29,48.61 59.32,47.64 56.99,47.64 55.91,46.56 U1.13
REFO: length 15.4
  Top Layer w0.127: 37.81,23.23 38.32,23.23
  Top Layer w0.254: U2.10 37.2,23.83 37.81,23.23 36.5,23.23 ; 36.5,23.23 35.18,23.23 ; 36.5,23.23 35.7,24.02 U2.7 ; 35.18,23.23 34.7,23.71 U2.5 ; 35.18,23.23 33.87,23.23 33.7,23.39 U2.3 ; 35.18,23.23 35.2,23.25 U2.6
RLY0: length 35.8
  Top Layer w0.127: v1(34.51,45.41) 36.95,45.41 37.01,45.47
  Top Layer w0.254: v1(26,35.38) v1(26,45.41)
  Bottom Layer w0.254: v1(34.51,45.41) v1(26,45.41) ; 11.21,35.51 11.19,35.53
  Bottom Layer w0.508: J14.3 v1(26,35.38)
RLY1: length 54.7
  Top Layer w0.127: 28.46,8.89 28.46,19.43 v1(28.54,19.51) ; v1(23.46,44.91) v1(23.46,19.51) ; 37.01,44.97 v1(35.27,44.97)
  Bottom Layer w0.127: v1(28.54,19.51) v1(23.46,19.51) ; v1(23.46,44.91) 35.21,44.91 v1(35.27,44.97)
RX1: length 33.3
  Top Layer w0.127: 37.01,43.47 35.31,43.47 v1(35.27,43.51) ; v1(22.82,51) v1(22.82,43.51)
  Bottom Layer w0.127: v1(35.27,43.51) v1(22.82,43.51)
  Bottom Layer w0.254: v1(22.82,51) J1.1
RX2: length 88.4
  Top Layer w0.127: v1(24.09,43) v1(24.09,14.43) ; 37.01,42.97 34.54,42.97 v1(34.51,43) ; J2.1 v1(65.62,14.3)
  Bottom Layer w0.127: v1(65.62,14.3) 24.22,14.3 v1(24.09,14.43) ; v1(34.51,43) v1(24.09,43)
TX1: length 35.4
  Top Layer w0.127: 37.01,43.97 36.96,44.02 v1(34.51,44.02) ; v1(24.6,53.54) v1(24.6,44.02)
  Bottom Layer w0.127: v1(34.51,44.02) v1(24.6,44.02)
  Bottom Layer w0.254: J1.2 v1(24.6,53.54)
TX2: length 84.2
  Top Layer w0.127: v1(35.27,42.49) 36.98,42.49 37.01,42.47 ; J2.2 63.08,14.68 ; v1(24.6,14.93) v1(24.6,42.49)
  Bottom Layer w0.127: v1(63.08,14.81) 24.73,14.81 v1(24.6,14.93) ; v1(24.6,42.49) v1(35.27,42.49)
$1N7062: length 8.1
  Top Layer w0.127: U1.14 54.31,47.06 54.57,47.32 54.57,49.35 54.95,49.73 55.97,49.73 56.1,49.86 56.1,52.11 C14.1 55.97,52.06
$1N7469: length 2.6
  Top Layer w0.127: 39.71,56.93 39.92,56.73 39.92,54.46
$1N8680: length 3.4
  Top Layer w0.127: 47.91,38.57 47.91,35.24 R1.1
$1N14131: length 1.9
  Top Layer w0.127: U1.73 35.23,41.56 35.18,41.6
$1N14803: length 1.6
  Top Layer w0.127: R4.2 LED1.2

## Copper pours and planes (outline as drawn; the poured copper is in the pictures)
GND on Top Layer: -9.18,74.88 89.5,74.88 89.5,-12.75 -9.18,-12.75
GND on Bottom Layer: -6.89,73.99 88.99,73.99 88.99,-6.66 -6.89,-6.66

Small or netless copper shapes (teardrops, artwork), in the pictures only: 483 on Top Layer, 179 on Bottom Layer

## Text on the board
Top Silkscreen Layer: HC-C0 | HC-B0 | HC-A0 | AD4 | AD7 | AD5 | AD3 | AD2 | AD6 | AD1 | +3V3 | GND | +5V | HC-C1 | HC-B1 | HC-A1 | CH1-OUT | DIO-RA0 | DAC0 | RX1 | K1 | K2 | K3 | K4 | K5 | K6 | K7 | K8 | K9 | K10 | K11 | K12 | K13 | K14 | K15 | RX2 | RLY0 | TX1 | CLK | DIO | DAC1 | DIO-RA1 | TX2 | CH2-OUT | RLY1 | FREQ
